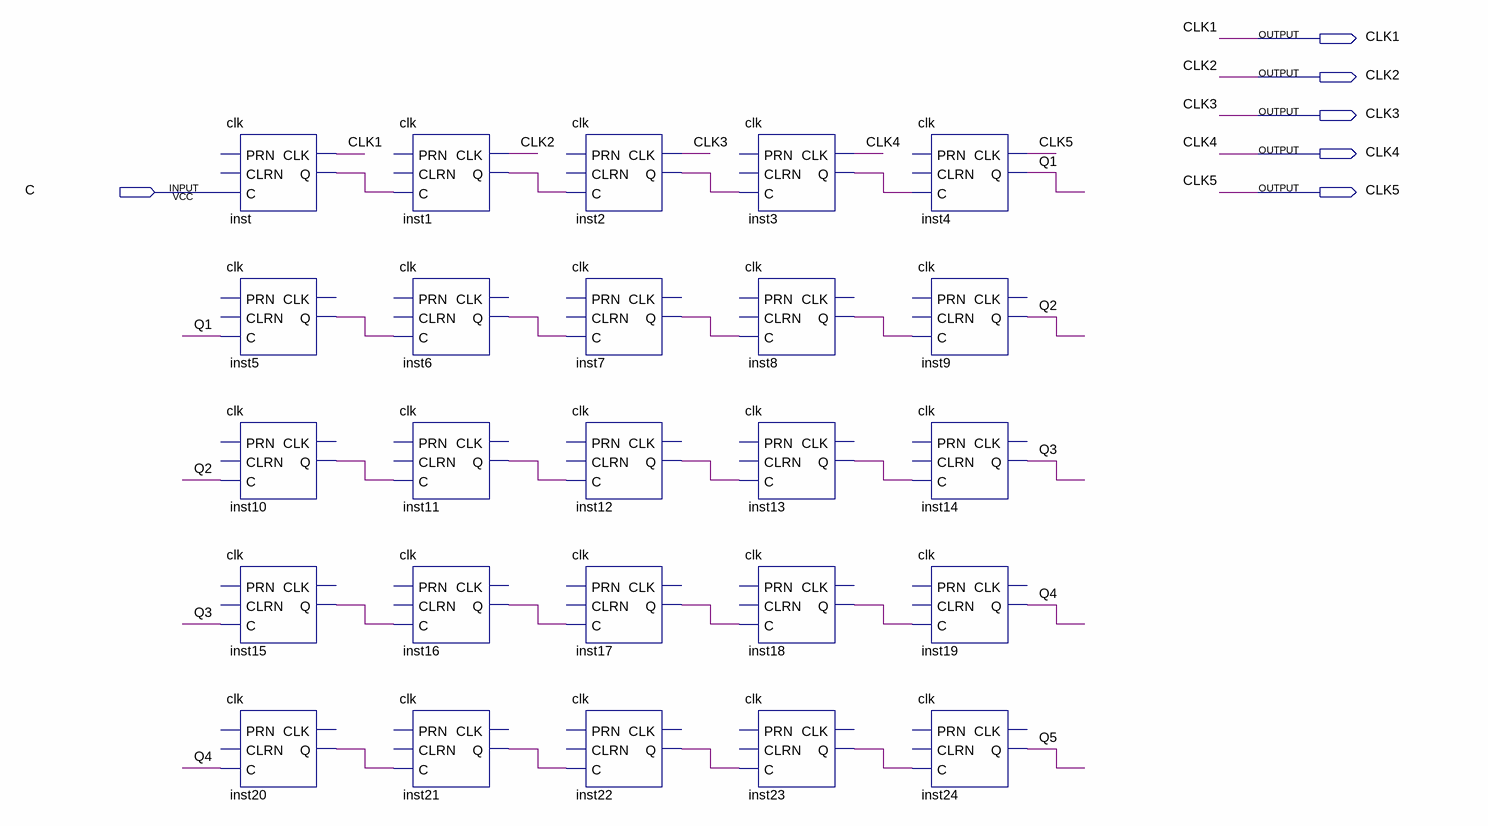
[diagram p0: schematic sheet]
// Quartus schematic divfreq.bdf as structural Verilog: 25 symbols, 6 pins
module divfreq (
  input  C,
  output CLK1,
  output CLK2,
  output CLK3,
  output CLK4,
  output CLK5
);

  wire inst1_q, inst2_q, inst3_q, inst5_q, inst6_q, inst7_q, inst8_q, inst10_q, inst11_q, inst12_q, inst13_q,
       inst15_q, inst16_q, inst17_q, inst18_q, inst20_q, inst21_q, inst22_q, inst23_q, inst_q, Q1, Q2, Q3,
       Q4, Q5;

  clk inst (.C(C), .CLK(CLK1), .Q(inst_q));  // open: PRN, CLRN
  clk inst5 (.C(Q1), .Q(inst5_q));  // open: PRN, CLRN, CLK
  clk inst10 (.C(Q2), .Q(inst10_q));  // open: PRN, CLRN, CLK
  clk inst15 (.C(Q3), .Q(inst15_q));  // open: PRN, CLRN, CLK
  clk inst20 (.C(Q4), .Q(inst20_q));  // open: PRN, CLRN, CLK
  clk inst1 (.C(inst_q), .CLK(CLK2), .Q(inst1_q));  // open: PRN, CLRN
  clk inst6 (.C(inst5_q), .Q(inst6_q));  // open: PRN, CLRN, CLK
  clk inst11 (.C(inst10_q), .Q(inst11_q));  // open: PRN, CLRN, CLK
  clk inst16 (.C(inst15_q), .Q(inst16_q));  // open: PRN, CLRN, CLK
  clk inst21 (.C(inst20_q), .Q(inst21_q));  // open: PRN, CLRN, CLK
  clk inst2 (.C(inst1_q), .CLK(CLK3), .Q(inst2_q));  // open: PRN, CLRN
  clk inst7 (.C(inst6_q), .Q(inst7_q));  // open: PRN, CLRN, CLK
  clk inst12 (.C(inst11_q), .Q(inst12_q));  // open: PRN, CLRN, CLK
  clk inst17 (.C(inst16_q), .Q(inst17_q));  // open: PRN, CLRN, CLK
  clk inst22 (.C(inst21_q), .Q(inst22_q));  // open: PRN, CLRN, CLK
  clk inst3 (.C(inst2_q), .CLK(CLK4), .Q(inst3_q));  // open: PRN, CLRN
  clk inst8 (.C(inst7_q), .Q(inst8_q));  // open: PRN, CLRN, CLK
  clk inst13 (.C(inst12_q), .Q(inst13_q));  // open: PRN, CLRN, CLK
  clk inst18 (.C(inst17_q), .Q(inst18_q));  // open: PRN, CLRN, CLK
  clk inst23 (.C(inst22_q), .Q(inst23_q));  // open: PRN, CLRN, CLK
  clk inst4 (.C(inst3_q), .CLK(CLK5), .Q(Q1));  // open: PRN, CLRN
  clk inst9 (.C(inst8_q), .Q(Q2));  // open: PRN, CLRN, CLK
  clk inst14 (.C(inst13_q), .Q(Q3));  // open: PRN, CLRN, CLK
  clk inst19 (.C(inst18_q), .Q(Q4));  // open: PRN, CLRN, CLK
  clk inst24 (.C(inst23_q), .Q(Q5));  // open: PRN, CLRN, CLK
endmodule
